# EAGLE design ftdi breakout (EAGLE 6.1)
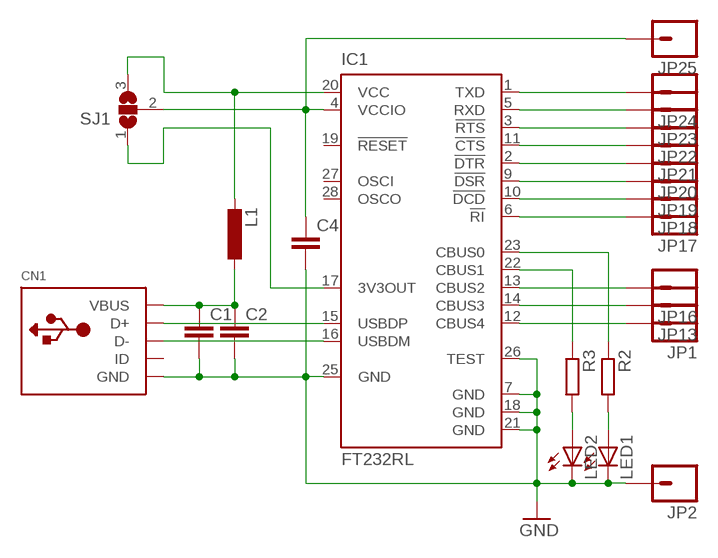
[diagram p0: schematic, sheet 1]

## Parts
C1  C-EUC1206K  [C1206K]
C2  C-EUC1206K  [C1206K]
C4  C-EUC1206K  [C1206K]
CN1  USBMINIB  [USB-MINIB]
IC1  FT232RL  [SSOP28]
JP1  M01PTH_LONGPAD  [1X01_LONGPAD]
JP2  M01PTH_LONGPAD  [1X01_LONGPAD]
JP13  M01PTH_LONGPAD  [1X01_LONGPAD]
JP16  M01PTH_LONGPAD  [1X01_LONGPAD]
JP17  M01PTH_LONGPAD  [1X01_LONGPAD]
JP18  M01PTH_LONGPAD  [1X01_LONGPAD]
JP19  M01PTH_LONGPAD  [1X01_LONGPAD]
JP20  M01PTH_LONGPAD  [1X01_LONGPAD]
JP21  M01PTH_LONGPAD  [1X01_LONGPAD]
JP22  M01PTH_LONGPAD  [1X01_LONGPAD]
JP23  M01PTH_LONGPAD  [1X01_LONGPAD]
JP24  M01PTH_LONGPAD  [1X01_LONGPAD]
JP25  M01PTH_LONGPAD  [1X01_LONGPAD]
L1  L-EUL2825P  [L2825P]
LED1  LEDCHIPLED_0805  [CHIPLED_0805]
LED2  LEDCHIPLED_0805  [CHIPLED_0805]
R2  R-EU_M0805  [M0805]
R3  R-EU_R0805  [R0805]
SJ1  SJ2W  [SJ_2]

## Nets
GND: C1.2 C2.2 C4.2 CN1.GND IC1.7(GND) IC1.18(GND) IC1.21(GND) IC1.25(GND) IC1.26(TEST) JP2.1 LED1.C LED2.C
N$1: IC1.23(CBUS0) R2.1
N$2: CN1.D+ IC1.15(USBDP)
N$3: CN1.D- IC1.16(USBDM)
N$4: C1.1 C2.1 CN1.VBUS L1.1
N$5: IC1.20(VCC) L1.2 SJ1.3
N$6: C4.1 IC1.4(VCCIO) JP25.1 SJ1.2
N$7: IC1.17(3V3OUT) SJ1.1
N$8: LED2.A R3.2
N$9: LED1.A R2.2
N$10: IC1.22(CBUS1) R3.1
N$11: IC1.6(!RI) JP17.1
N$12: IC1.10(!DCD) JP18.1
N$13: IC1.9(!DSR) JP19.1
N$14: IC1.2(!DTR) JP20.1
N$15: IC1.11(!CTS) JP21.1
N$16: IC1.3(!RTS) JP22.1
N$17: IC1.5(RXD) JP23.1
N$18: IC1.1(TXD) JP24.1
N$19: IC1.12(CBUS4) JP1.1
N$20: IC1.13(CBUS2) JP16.1
N$21: IC1.14(CBUS3) JP13.1
Unconnected: CN1.ID IC1.19(!RESET) IC1.27(OSCI) IC1.28(OSCO)

## Library data of the parts
C1 C2 C4 = rcl:C-EU: CAPACITOR, European symbol
CN1 = adafruit:USB: USB Connectors USBMINIB - Surface Mount Female Mini-B USB Connector 4UConnector: 06564 By microbuilder.eu Thru-hole RA Female Mini-B USB Connector 4UConnector: 18732 By ladyada.net
IC1 = ftdichip:FT232R: Source: http://www.ftdichip.com/Documents/DataSheets/DS_FT232R_v104.pdf; MPN: FT232RL; OC_FARNELL: 1146032; OC_NEWARK: 91K9918
JP1 JP2 JP13 JP16-JP25 = _MY_OWN_LIB:M01: Header 1 Standard 1-pin 0.1" header. Use with straight break away headers (SKU : PRT-00116), right angle break away headers (PRT-00553), swiss pins (PRT-00743), machine pins (PRT-00117), and female headers (PRT-00115).
L1 = rcl:L-EU: INDUCTOR, European symbol
LED1 LED2 = led:LED: LED OSRAM: - CHIPLED LG R971, LG N971, LY N971, LG Q971, LY Q971, LO R971, LY R971 LH N974, LH R974 LS Q976, LO Q976, LY Q976 LO Q996 - Hyper CHIPLED LW Q18S LB Q993, LB Q99A, LB R99A - SideLED LS A670, LO A670, LY A670, LG A670, LP A670 LB A673, LV A673, LT A673, LW A673 LH A674 LY A675 LS A676, LA A676, LO A676, LY A676, LW A676 LS A679, LY A679, LG A679 - Hyper Micro SIDELED® LS Y876, LA Y876, LO Y876, LY Y876 LT Y87S - SmartLED LW L88C, LW L88S LB L89C, LB L89S, LG L890 LS L89K, LO L89K, LY L89K LS L896, LA L896, LO L896, LY L896 - TOPLED LS T670, LO T670, LY T670, LG T670, LP T670 LSG T670, LSP T670, LSY T670, LOP T670, LYG T670 LG T671, LOG T671, LSG T671 LB T673, LV T673, LT T673, LW T673 LH T674 LS T676, LA T676, LO T676, LY T676, LB T676, LH T676, LSB T676, LW T676 LB T67C, LV T67C, LT T67C, LS T67K, LO T67K, LY T67K, LW E67C LS E67B, LA E67B, LO E67B, LY E67B, LB E67C, LV E67C, LT E67C LW T67C LS T679, LY T679, LG T679 LS T770, LO T770, LY T770, LG T770, LP T770 LB T773, LV T773, LT T773, LW T773 LH T774 LS E675, LA E675, LY E675, LS T675 LS T776, LA T776, LO T776, LY T776, LB T776 LHGB T686 LT T68C, LB T68C - Hyper Mini TOPLED® LB M676 - Mini TOPLED Santana® LG M470 LS M47K, LO M47K, LY M47K Source: http://www.osram.convergy.de LUXEON: - LUMILED® LXK2-PW12-R00, LXK2-PW12-S00, LXK2-PW14-U00, LXK2-PW14-V00 LXK2-PM12-R00, LXK2-PM12-S00, LXK2-PM14-U00 LXK2-PE12-Q00, LXK2-PE12-R00, LXK2-PE12-S00, LXK2-PE14-T00, LXK2-PE14-U00 LXK2-PB12-K00, LXK2-PB12-L00, LXK2-PB12-M00, LXK2-PB14-N00, LXK2-PB14-P00, LXK2-PB14-Q00 LXK2-PR12-L00, LXK2-PR12-M00, LXK2-PR14-Q00, LXK2-PR14-R00 LXK2-PD12-Q00, LXK2-PD12-R00, LXK2-PD12-S00 LXK2-PH12-R00, LXK2-PH12-S00 LXK2-PL12-P00, LXK2-PL12-Q00, LXK2-PL12-R00 Source: www.luxeon.com KINGBRIGHT: KA-3528ASYC Source: www.kingbright.com
R2 R3 = rcl:R-EU_: RESISTOR, European symbol
SJ1 = jumper:SJ2W: SMD solder JUMPER

## Board
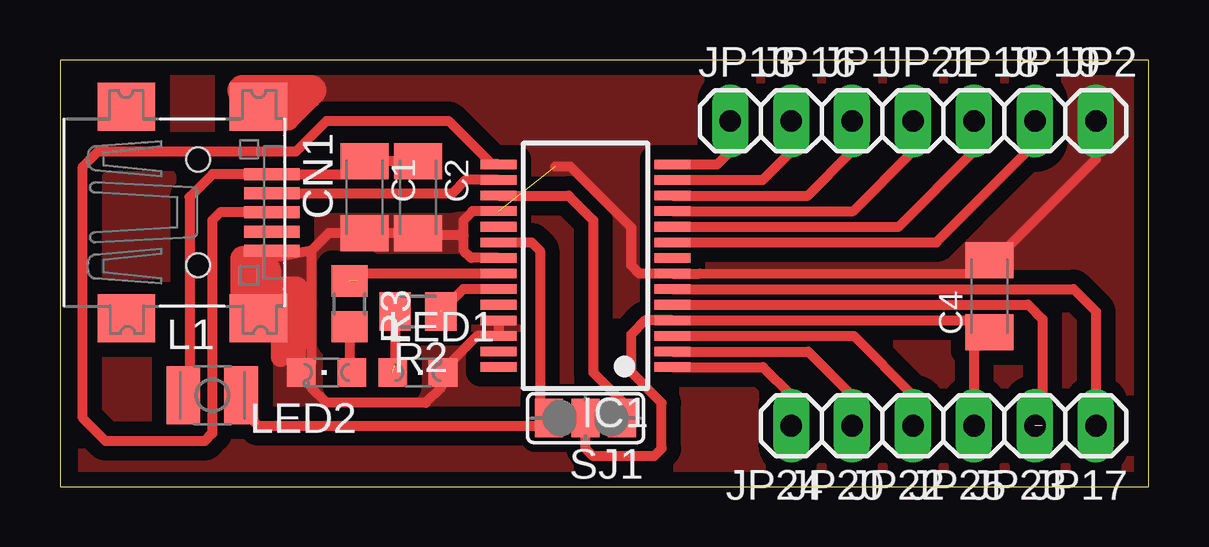
[diagram p1: board, top side]

Size 45.38 x 17.77 mm. Coordinates in mm from the lower left corner, seen from the top.
Outline: 0,0 45.38,0 45.38,17.77 0,17.77 0,0
Copper layers (1*16): Top 0.035mm / dielectric 1.5mm / Bottom 0.035mm
Design rules: minimum track width 10mil, minimum drill 24mil, track to track 12mil, track to pad 12mil, pad to pad 12mil, via to via 12mil, smd to smd 10mil, copper to edge 12mil, drill to drill 12mil, minimum pad ring 10mil, minimum via ring 10mil, stop-mask expansion 4mil, vias tented up to drill 0mil, thermal gap 12mil

### Footprints (pad centres in the part's own frame; a part is rotated, then mirrored left to right if it is on the bottom)
C1206K = smd 1.5 x 2: 1 -1.5,0; 2 1.5,0
USB-MINIB = smd 0.5 x 2.308: D+ 0,4.064; D- -0.8,4.064; GND 1.6,4.064; ID 0.8,4.064; VBUS -1.6,4.064 | smd 2 x 2.4: GND1 -4.4,-2; GND2 -4.4,3.5; GND3 4.4,3.5; GND4 4.4,-2 | hole 1: -2.2,1; 2.2,1
SSOP28 = smd 0.4 x 1.5: 1 -4.225,-3.625; 2 -3.575,-3.625; 3 -2.925,-3.625; 4 -2.275,-3.625; 5 -1.625,-3.625; 6 -0.975,-3.625; 7 -0.325,-3.625; 8 0.325,-3.625; 9 0.975,-3.625; 10 1.625,-3.625; 11 2.275,-3.625; 12 2.925,-3.625; 13 3.575,-3.625; 14 4.225,-3.625; 15 4.225,3.625; 16 3.575,3.625; 17 2.925,3.625; 18 2.275,3.625; 19 1.625,3.625; 20 0.975,3.625; 21 0.325,3.625; 22 -0.325,3.625; 23 -0.975,3.625; 24 -1.625,3.625; 25 -2.275,3.625; 26 -2.925,3.625; 27 -3.575,3.625; 28 -4.225,3.625
1X01_LONGPAD = drill 0.9 pad 1.524 long: 1 0,0
L2825P = smd 1.4 x 2.4: 1 -1.2,0; 2 1.2,0
CHIPLED_0805 = smd 1.2 x 1.2: A 0,-1.05; C 0,1.05
M0805 = smd 1.3 x 1.6: 1 -0.95,0; 2 0.95,0
R0805 = smd 1.3 x 1.5: 1 -0.95,0; 2 0.95,0
SJ_2 = smd 1.168 x 1.6: 1 -1.524,0; 2 0,0; 3 1.524,0

### Placement (x,y rotation side)
C1  12.7,12.06 270 top
C2  14.92,12.06 270 top
C4  38.73,7.94 90 top
CN1  4.76,11.43 270 top
IC1  21.91,9.21 90 top
JP1  33.02,15.24 0 top
JP2  43.18,15.24 0 top
JP13  27.94,15.24 0 top
JP16  30.48,15.24 0 top
JP17  43.18,2.54 180 top
JP18  38.1,15.24 0 top
JP19  40.64,15.24 0 top
JP20  33.02,2.54 180 top
JP21  35.56,15.24 0 top
JP22  35.56,2.54 180 top
JP23  40.64,2.54 180 top
JP24  30.48,2.54 180 top
JP25  38.1,2.54 180 top
L1  6.35,3.81 0 top
LED1  14.92,4.76 270 top
LED2  11.11,4.76 90 top
R2  14.92,7.3 180 top
R3  12.06,7.62 270 top
SJ1  21.91,2.86 180 top

### Tracks (layer width: path | path; a pad name or v marks a point on that pad's centre or on a via)
GND  (1 unrouted)
  Top 0.406: 12.6,10.46 C1.2 11.2,10.56 10.48,9.84 | IC1.18 17.2,11.48 16.83,11.11 16.83,10.48 | 16.83,10.48 15.01,10.48 C2.2 12.79,10.56 12.7,10.48 | IC1.21 17.14,9.53 16.83,9.84 16.83,10.48 | IC1.25 IC1.26 17.39,6.28 16.19,5.08 15.88,5.08 15.88,4.13 15.24,3.49 11.11,3.49 10.48,4.13 10.48,5.18 | 10.48,9.84 8.84,9.53 | 8.26,8.89 8.84,9.53 | 8.84,9.53 CN1.GND | 10.48,9.84 10.48,5.18 | 10.48,5.18 LED2.C | 20.64,13.34 21.27,13.34 23.81,10.79 23.81,9.21 24.14,8.88 IC1.7 26.66,8.88 38.42,8.89 43.18,13.65 JP2.1 | 8.26,15.88 7.62,16.51
  Top 0.813: 9.21,15.24 9.53,15.24 10.48,16.19 9.84,16.19 9.53,15.88 | 9.84,6.03 9.84,4.98 LED2.C | 9.53,5.71 9.21,5.4 9.21,6.67 8.89,6.99
  Top 1.016: 9.21,8.26 9.84,8.26 9.84,6.03 9.53,5.71
  Top 1.27: 7.62,16.51 10.48,16.51
  Top 1.93: 8.26,8.89 8.26,7.3
  pour Top (isolate 0.61, no thermals): 0.95,17.14 0.95,0.64 44.77,0.64 44.77,17.14
N$1  (1 unrouted)
  Top 0.406: IC1.23 16.8,8.23 R2.1
N$2
  Top 0.406: IC1.15 18,13.43 16.19,15.24 11.11,15.24 9.84,13.97 1.59,13.97 0.95,13.34 0.95,2.86 1.91,1.91 6.03,1.91 6.35,2.22 6.35,11.11 6.67,11.43 CN1.D+
N$3
  Top 0.406: CN1.D- 16.36,12.23 16.91,12.78 IC1.16
N$4
  Top 0.406: C2.1 C1.1 | C1.1 12.47,13.56 12.38,13.65 | 12.48,13.35 C1.1 | L1.1 5.4,3.88 5.4,12.06 6.36,13.03 CN1.VBUS 12.08,13.03 12.38,13.34 12.47,13.34 C1.1
N$5
  Top 0.406: L1.2 7.55,3.25 8.26,2.54 20,2.54 20,2.86 | IC1.20 19.66,10.18 20,9.84 20,2.86 | SJ1.3 20,2.86
N$6
  Top 0.406: 39,6.93 IC1.4 24.39,6.93 23.81,6.35 23.81,4.76 25.08,3.49 25.08,1.59 24.77,1.27 22.23,1.27 21.91,1.59 SJ1.2 | 39,6.93 39.05,6.99 | 39,6.93 39,6.49 C4.1 38.65,6.44 38.65,6.26 38.1,5.71 JP25.1
N$7  (1 unrouted)
  Top 0.406: IC1.17 21.2,12.13 22.23,11.11 22.23,4.76 23.5,3.49 23.5,2.86
N$8
  Top 0.406: R3.2 12.06,5.18 LED2.A
N$9  (1 unrouted)
  Top 0.406: R2.2 13.97,5.08
N$10  (1 unrouted)
  Top 0.406: IC1.22 12.69,8.88 12.38,8.57
N$11
  Top 0.406: IC1.6 42.25,8.23 43.18,7.3 JP17.1
N$12
  Top 0.406: IC1.10 34.96,10.83 38.1,13.97 JP18.1
N$13
  Top 0.406: IC1.9 36.53,10.18 40.64,14.29 JP19.1
N$14
  Top 0.406: IC1.2 31.2,5.63 33.02,3.81 JP20.1
N$15
  Top 0.406: IC1.11 33.07,11.48 35.56,13.97 JP21.1
N$16
  Top 0.406: IC1.3 33.09,6.28 35.56,3.81 JP22.1
N$17  (1 unrouted)
  Top 0.406: IC1.5 40.36,7.58 40.96,6.99 40.96,2.54
N$18
  Top 0.406: IC1.1 29.31,4.98 30.48,3.81 JP24.1
N$19
  Top 0.406: IC1.12 31.18,12.13 33.02,13.97 JP1.1
N$20
  Top 0.406: IC1.13 29.29,12.78 30.48,13.97 JP16.1
N$21
  Top 0.406: IC1.14 27.4,13.43 27.94,13.97 JP13.1
N$23
  Top 1.016: 7.62,7.62 7.62,9.53